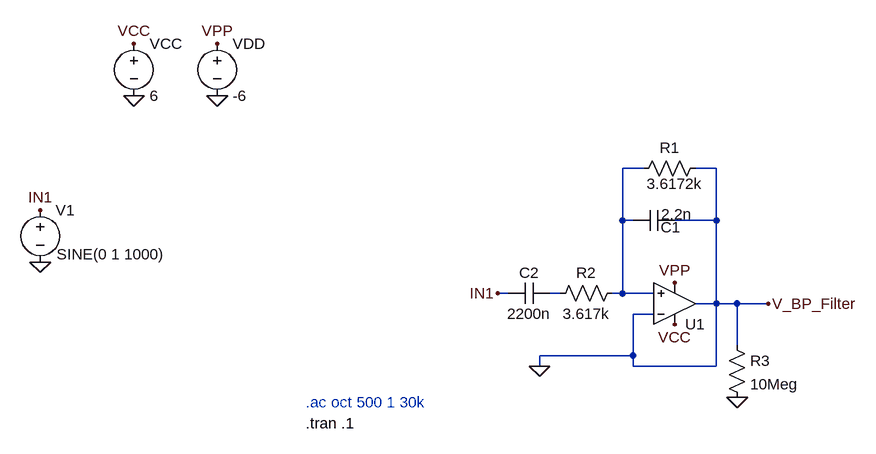
[diagram p0: schematic Filtre_passe_bande.asc]
Filtre_passe_bande.asc, the LTspice schematic file:
Version 4
SHEET 1 3580 680
WIRE 256 -80 224 -80
WIRE 368 -80 336 -80
WIRE 224 0 224 -80
WIRE 240 0 224 0
WIRE 368 0 368 -80
WIRE 368 0 304 0
WIRE 48 112 32 112
WIRE 128 112 112 112
WIRE 224 112 224 0
WIRE 224 112 208 112
WIRE 272 112 224 112
WIRE 368 128 368 0
WIRE 368 128 336 128
WIRE 400 128 368 128
WIRE 448 128 400 128
WIRE 272 144 240 144
WIRE 400 192 400 128
WIRE 240 208 240 144
WIRE 240 208 96 208
WIRE 96 224 96 208
WIRE 240 224 240 208
WIRE 368 224 368 128
WIRE 368 224 240 224
FLAG -672 64 0
FLAG -672 -16 IN1
FLAG -528 -192 0
FLAG -400 -192 0
FLAG -528 -272 VCC
FLAG -400 -272 VPP
FLAG 304 160 VCC
FLAG 304 96 VPP
FLAG 96 224 0
FLAG 448 128 V_BP_Filter
FLAG 400 272 0
FLAG 32 112 IN1
SYMBOL voltage -672 -32 R0
WINDOW 3 25 84 Left 2
WINDOW 123 25 112 Left 2
WINDOW 39 0 0 Left 0
SYMATTR Value SINE(0 1 1000)
SYMATTR InstName V1
SYMBOL OpAmps\\UniversalOpAmp 304 128 M180
SYMATTR InstName U1
SYMBOL res 224 96 R90
WINDOW 0 0 56 VBottom 2
WINDOW 3 32 56 VTop 2
SYMATTR InstName R2
SYMATTR Value 3.617k
SYMBOL voltage -528 -288 R0
WINDOW 123 0 0 Left 0
WINDOW 39 0 0 Left 0
SYMATTR InstName VCC
SYMATTR Value 6
SYMBOL voltage -400 -288 R0
WINDOW 123 0 0 Left 0
WINDOW 39 0 0 Left 0
SYMATTR InstName VDD
SYMATTR Value -6
SYMBOL cap 112 96 R90
WINDOW 0 0 32 VBottom 2
WINDOW 3 32 32 VTop 2
SYMATTR InstName C2
SYMATTR Value 2200n
SYMBOL cap 304 -16 R90
WINDOW 0 42 6 VBottom 2
WINDOW 3 -9 -3 VTop 2
SYMATTR InstName C1
SYMATTR Value 2.2n
SYMBOL res 352 -96 R90
WINDOW 0 0 56 VBottom 2
WINDOW 3 24 48 VTop 2
SYMATTR InstName R1
SYMATTR Value 3.6172k
SYMBOL res 384 176 R0
SYMATTR InstName R3
SYMATTR Value 10Meg
TEXT -264 280 Left 2 ;.ac oct 500 1 30k
TEXT -264 312 Left 2 !.tran .1

The netlist it stands for:
* Filtre_passe_bande.asc
V1 IN1 0 SINE(0 1 1000)
XU1 N001 0 VCC VPP 0 level1 Avol=1Meg GBW=10Meg Vos=0 En=0 Enk=0 In=0 Ink=0 Rin=500Meg  ; pins In+ In- V+ V- OUT
R2 N001 N002 3.617k
VCC VCC 0 6
VDD VPP 0 -6
C2 N002 IN1 2200n
C1 0 N001 2.2n
R1 0 N001 3.6172k
R3 0 0 10Meg
* .ac oct 500 1 30k
.tran .1
.lib UniversalOpAmp1.lib
.backanno
.end